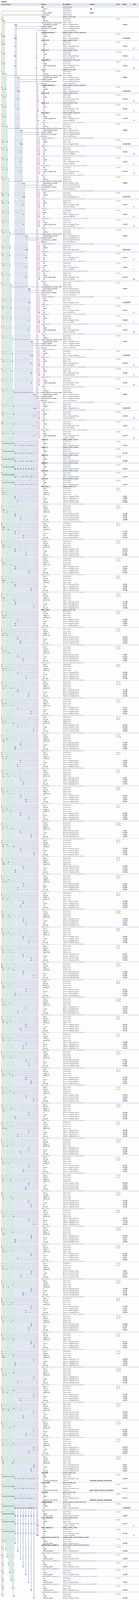
[diagram p0: system contents, whole]
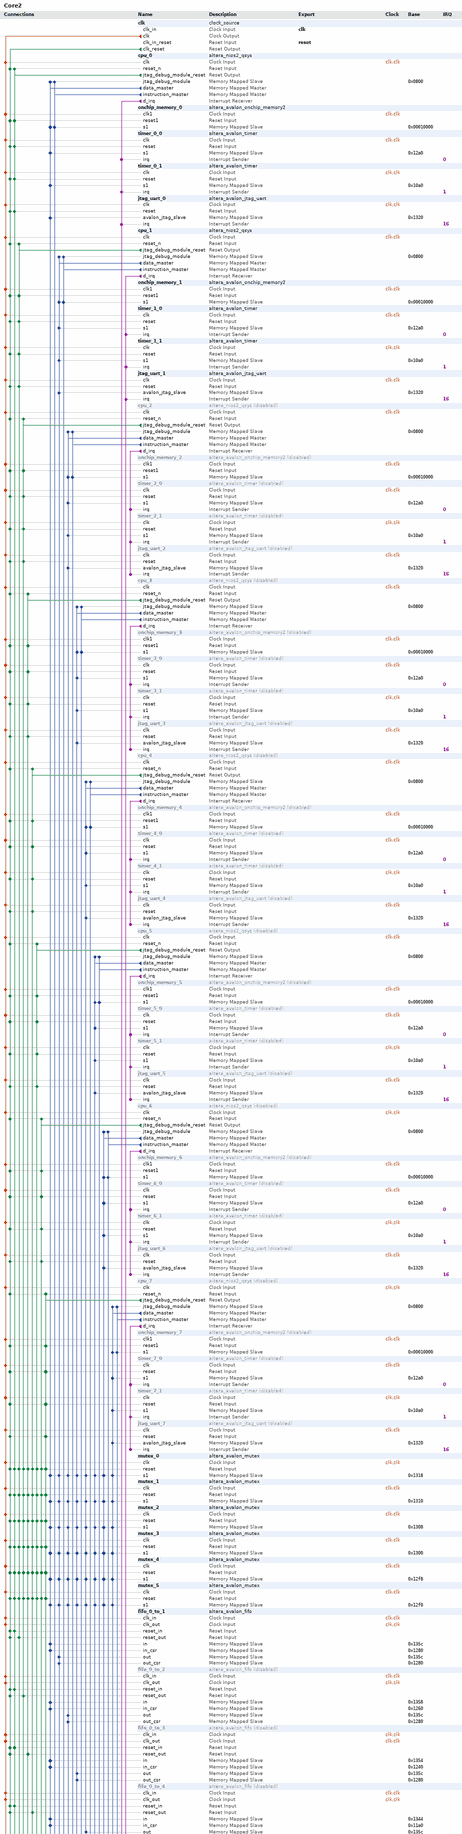
[diagram p1: system contents, upper part]
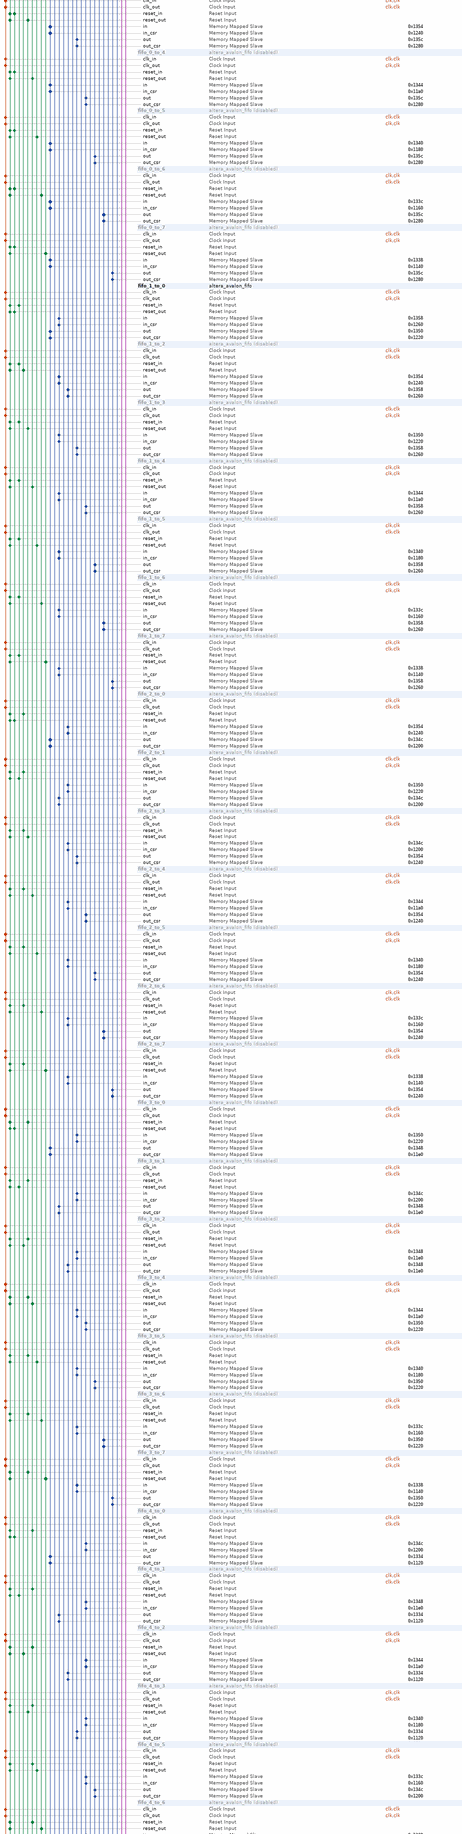
[diagram p2: system contents, middle part]
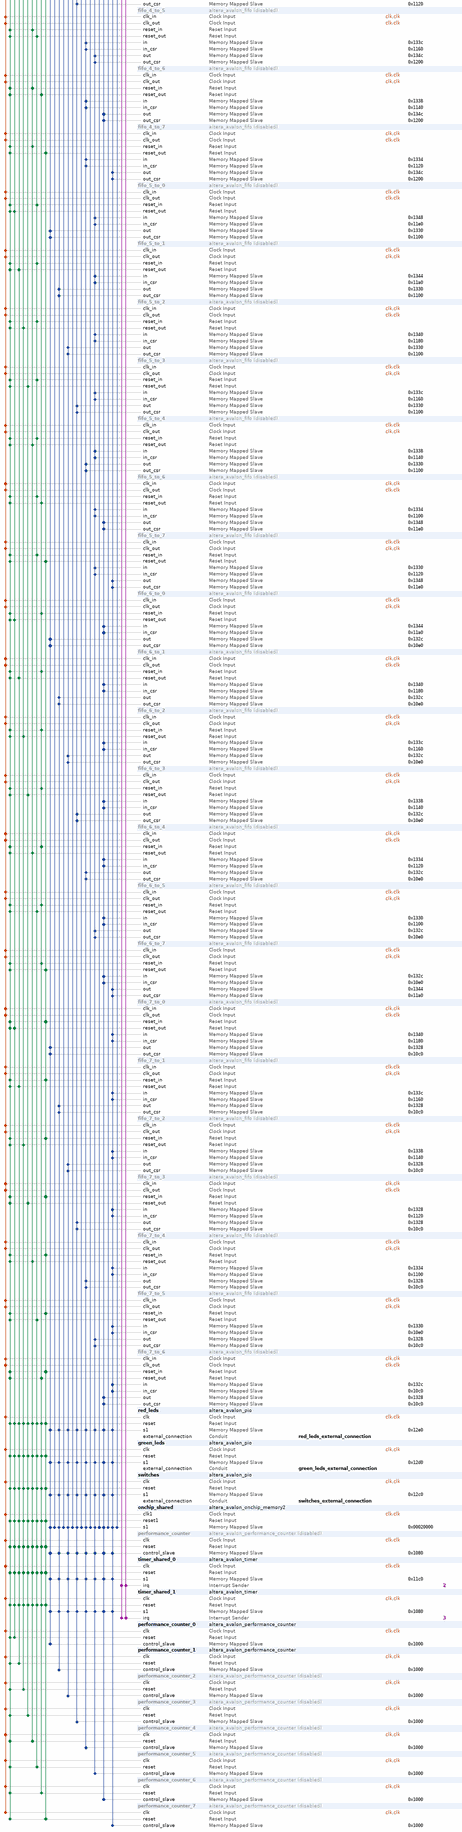
[diagram p3: system contents, lower part]
# Platform Designer (Qsys) system Core2, Cyclone IV E EP4CE115F29C7
# Parameters at their usual value, and those the tool derives, are not listed.
package require -exact qsys 13.0.1.99.2
create_system Core2
set_project_property DEVICE_FAMILY {Cyclone IV E}
set_project_property DEVICE EP4CE115F29C7

add_instance clk clock_source 13.0
set_instance_parameter_value clk clockFrequency 50000000

add_instance cpu_0 altera_nios2_qsys 13.0
set_instance_parameter_value cpu_0 cpuID 1
set_instance_parameter_value cpu_0 resetSlave onchip_memory_0.s1
set_instance_parameter_value cpu_0 mmu_TLBMissExcSlave None
set_instance_parameter_value cpu_0 exceptionSlave onchip_memory_0.s1
set_instance_parameter_value cpu_0 breakSlave cpu_0.jtag_debug_module
set_instance_parameter_value cpu_0 impl Tiny
set_instance_parameter_value cpu_0 icache_size 4096

add_instance onchip_memory_0 altera_avalon_onchip_memory2 13.0.1.99.2
set_instance_parameter_value onchip_memory_0 dataWidth 32
set_instance_parameter_value onchip_memory_0 dualPort false
set_instance_parameter_value onchip_memory_0 initMemContent true
set_instance_parameter_value onchip_memory_0 initializationFileName onchip_mem.hex
set_instance_parameter_value onchip_memory_0 memorySize 32768

add_instance timer_0_0 altera_avalon_timer 13.0.1.99.2
set_instance_parameter_value timer_0_0 period 1
set_instance_parameter_value timer_0_0 periodUnits MSEC

add_instance timer_0_1 altera_avalon_timer 13.0.1.99.2
set_instance_parameter_value timer_0_1 period 1
set_instance_parameter_value timer_0_1 periodUnits MSEC

add_instance jtag_uart_0 altera_avalon_jtag_uart 13.0.1.99.2
set_instance_parameter_value jtag_uart_0 simInteractiveOptions NO_INTERACTIVE_WINDOWS

add_instance cpu_1 altera_nios2_qsys 13.0
set_instance_parameter_value cpu_1 cpuID 2
set_instance_parameter_value cpu_1 resetSlave onchip_memory_1.s1
set_instance_parameter_value cpu_1 mmu_TLBMissExcSlave None
set_instance_parameter_value cpu_1 exceptionSlave onchip_memory_1.s1
set_instance_parameter_value cpu_1 breakSlave cpu_1.jtag_debug_module
set_instance_parameter_value cpu_1 impl Tiny
set_instance_parameter_value cpu_1 icache_size 4096

add_instance onchip_memory_1 altera_avalon_onchip_memory2 13.0.1.99.2
set_instance_parameter_value onchip_memory_1 dataWidth 32
set_instance_parameter_value onchip_memory_1 dualPort false
set_instance_parameter_value onchip_memory_1 initMemContent true
set_instance_parameter_value onchip_memory_1 initializationFileName onchip_mem.hex
set_instance_parameter_value onchip_memory_1 memorySize 32768

add_instance timer_1_0 altera_avalon_timer 13.0.1.99.2
set_instance_parameter_value timer_1_0 period 1
set_instance_parameter_value timer_1_0 periodUnits MSEC

add_instance timer_1_1 altera_avalon_timer 13.0.1.99.2
set_instance_parameter_value timer_1_1 period 1
set_instance_parameter_value timer_1_1 periodUnits MSEC

add_instance jtag_uart_1 altera_avalon_jtag_uart 13.0.1.99.2
set_instance_parameter_value jtag_uart_1 simInteractiveOptions NO_INTERACTIVE_WINDOWS

add_instance cpu_2 altera_nios2_qsys 13.0
set_instance_property cpu_2 ENABLED false
set_instance_parameter_value cpu_2 cpuID 3
set_instance_parameter_value cpu_2 resetSlave onchip_memory_2.s1
set_instance_parameter_value cpu_2 mmu_TLBMissExcSlave None
set_instance_parameter_value cpu_2 exceptionSlave onchip_memory_2.s1
set_instance_parameter_value cpu_2 breakSlave cpu_2.jtag_debug_module
set_instance_parameter_value cpu_2 impl Tiny
set_instance_parameter_value cpu_2 icache_size 4096

add_instance onchip_memory_2 altera_avalon_onchip_memory2 13.0.1.99.2
set_instance_property onchip_memory_2 ENABLED false
set_instance_parameter_value onchip_memory_2 dataWidth 32
set_instance_parameter_value onchip_memory_2 dualPort false
set_instance_parameter_value onchip_memory_2 initMemContent true
set_instance_parameter_value onchip_memory_2 initializationFileName onchip_mem.hex
set_instance_parameter_value onchip_memory_2 memorySize 32768

add_instance timer_2_0 altera_avalon_timer 13.0.1.99.2
set_instance_property timer_2_0 ENABLED false
set_instance_parameter_value timer_2_0 period 1
set_instance_parameter_value timer_2_0 periodUnits MSEC

add_instance timer_2_1 altera_avalon_timer 13.0.1.99.2
set_instance_property timer_2_1 ENABLED false
set_instance_parameter_value timer_2_1 period 1
set_instance_parameter_value timer_2_1 periodUnits MSEC

add_instance jtag_uart_2 altera_avalon_jtag_uart 13.0.1.99.2
set_instance_property jtag_uart_2 ENABLED false
set_instance_parameter_value jtag_uart_2 simInteractiveOptions NO_INTERACTIVE_WINDOWS

add_instance cpu_3 altera_nios2_qsys 13.0
set_instance_property cpu_3 ENABLED false
set_instance_parameter_value cpu_3 cpuID 4
set_instance_parameter_value cpu_3 resetSlave onchip_memory_3.s1
set_instance_parameter_value cpu_3 mmu_TLBMissExcSlave None
set_instance_parameter_value cpu_3 exceptionSlave onchip_memory_3.s1
set_instance_parameter_value cpu_3 breakSlave cpu_3.jtag_debug_module
set_instance_parameter_value cpu_3 impl Tiny
set_instance_parameter_value cpu_3 icache_size 4096

add_instance onchip_memory_3 altera_avalon_onchip_memory2 13.0.1.99.2
set_instance_property onchip_memory_3 ENABLED false
set_instance_parameter_value onchip_memory_3 dataWidth 32
set_instance_parameter_value onchip_memory_3 dualPort false
set_instance_parameter_value onchip_memory_3 initMemContent true
set_instance_parameter_value onchip_memory_3 initializationFileName onchip_mem.hex
set_instance_parameter_value onchip_memory_3 memorySize 32768

add_instance timer_3_0 altera_avalon_timer 13.0.1.99.2
set_instance_property timer_3_0 ENABLED false
set_instance_parameter_value timer_3_0 period 1
set_instance_parameter_value timer_3_0 periodUnits MSEC

add_instance timer_3_1 altera_avalon_timer 13.0.1.99.2
set_instance_property timer_3_1 ENABLED false
set_instance_parameter_value timer_3_1 period 1
set_instance_parameter_value timer_3_1 periodUnits MSEC

add_instance jtag_uart_3 altera_avalon_jtag_uart 13.0.1.99.2
set_instance_property jtag_uart_3 ENABLED false
set_instance_parameter_value jtag_uart_3 simInteractiveOptions NO_INTERACTIVE_WINDOWS

add_instance cpu_4 altera_nios2_qsys 13.0
set_instance_property cpu_4 ENABLED false
set_instance_parameter_value cpu_4 cpuID 5
set_instance_parameter_value cpu_4 resetSlave onchip_memory_4.s1
set_instance_parameter_value cpu_4 mmu_TLBMissExcSlave None
set_instance_parameter_value cpu_4 exceptionSlave onchip_memory_4.s1
set_instance_parameter_value cpu_4 breakSlave cpu_4.jtag_debug_module
set_instance_parameter_value cpu_4 impl Tiny
set_instance_parameter_value cpu_4 icache_size 4096

add_instance onchip_memory_4 altera_avalon_onchip_memory2 13.0.1.99.2
set_instance_property onchip_memory_4 ENABLED false
set_instance_parameter_value onchip_memory_4 dataWidth 32
set_instance_parameter_value onchip_memory_4 dualPort false
set_instance_parameter_value onchip_memory_4 initMemContent true
set_instance_parameter_value onchip_memory_4 initializationFileName onchip_mem.hex
set_instance_parameter_value onchip_memory_4 memorySize 32768

add_instance timer_4_0 altera_avalon_timer 13.0.1.99.2
set_instance_property timer_4_0 ENABLED false
set_instance_parameter_value timer_4_0 period 1
set_instance_parameter_value timer_4_0 periodUnits MSEC

add_instance timer_4_1 altera_avalon_timer 13.0.1.99.2
set_instance_property timer_4_1 ENABLED false
set_instance_parameter_value timer_4_1 period 1
set_instance_parameter_value timer_4_1 periodUnits MSEC

add_instance jtag_uart_4 altera_avalon_jtag_uart 13.0.1.99.2
set_instance_property jtag_uart_4 ENABLED false
set_instance_parameter_value jtag_uart_4 simInteractiveOptions NO_INTERACTIVE_WINDOWS

add_instance cpu_5 altera_nios2_qsys 13.0
set_instance_property cpu_5 ENABLED false
set_instance_parameter_value cpu_5 cpuID 6
set_instance_parameter_value cpu_5 resetSlave onchip_memory_5.s1
set_instance_parameter_value cpu_5 mmu_TLBMissExcSlave None
set_instance_parameter_value cpu_5 exceptionSlave onchip_memory_5.s1
set_instance_parameter_value cpu_5 breakSlave cpu_5.jtag_debug_module
set_instance_parameter_value cpu_5 impl Tiny
set_instance_parameter_value cpu_5 icache_size 4096

add_instance onchip_memory_5 altera_avalon_onchip_memory2 13.0.1.99.2
set_instance_property onchip_memory_5 ENABLED false
set_instance_parameter_value onchip_memory_5 dataWidth 32
set_instance_parameter_value onchip_memory_5 dualPort false
set_instance_parameter_value onchip_memory_5 initMemContent true
set_instance_parameter_value onchip_memory_5 initializationFileName onchip_mem.hex
set_instance_parameter_value onchip_memory_5 memorySize 32768

add_instance timer_5_0 altera_avalon_timer 13.0.1.99.2
set_instance_property timer_5_0 ENABLED false
set_instance_parameter_value timer_5_0 period 1
set_instance_parameter_value timer_5_0 periodUnits MSEC

add_instance timer_5_1 altera_avalon_timer 13.0.1.99.2
set_instance_property timer_5_1 ENABLED false
set_instance_parameter_value timer_5_1 period 1
set_instance_parameter_value timer_5_1 periodUnits MSEC

add_instance jtag_uart_5 altera_avalon_jtag_uart 13.0.1.99.2
set_instance_property jtag_uart_5 ENABLED false
set_instance_parameter_value jtag_uart_5 simInteractiveOptions NO_INTERACTIVE_WINDOWS

add_instance cpu_6 altera_nios2_qsys 13.0
set_instance_property cpu_6 ENABLED false
set_instance_parameter_value cpu_6 cpuID 7
set_instance_parameter_value cpu_6 resetSlave onchip_memory_6.s1
set_instance_parameter_value cpu_6 mmu_TLBMissExcSlave None
set_instance_parameter_value cpu_6 exceptionSlave onchip_memory_6.s1
set_instance_parameter_value cpu_6 breakSlave cpu_6.jtag_debug_module
set_instance_parameter_value cpu_6 impl Tiny
set_instance_parameter_value cpu_6 icache_size 4096

add_instance onchip_memory_6 altera_avalon_onchip_memory2 13.0.1.99.2
set_instance_property onchip_memory_6 ENABLED false
set_instance_parameter_value onchip_memory_6 dataWidth 32
set_instance_parameter_value onchip_memory_6 dualPort false
set_instance_parameter_value onchip_memory_6 initMemContent true
set_instance_parameter_value onchip_memory_6 initializationFileName onchip_mem.hex
set_instance_parameter_value onchip_memory_6 memorySize 32768

add_instance timer_6_0 altera_avalon_timer 13.0.1.99.2
set_instance_property timer_6_0 ENABLED false
set_instance_parameter_value timer_6_0 period 1
set_instance_parameter_value timer_6_0 periodUnits MSEC

add_instance timer_6_1 altera_avalon_timer 13.0.1.99.2
set_instance_property timer_6_1 ENABLED false
set_instance_parameter_value timer_6_1 period 1
set_instance_parameter_value timer_6_1 periodUnits MSEC

add_instance jtag_uart_6 altera_avalon_jtag_uart 13.0.1.99.2
set_instance_property jtag_uart_6 ENABLED false
set_instance_parameter_value jtag_uart_6 simInteractiveOptions NO_INTERACTIVE_WINDOWS

add_instance cpu_7 altera_nios2_qsys 13.0
set_instance_property cpu_7 ENABLED false
set_instance_parameter_value cpu_7 cpuID 8
set_instance_parameter_value cpu_7 resetSlave onchip_memory_7.s1
set_instance_parameter_value cpu_7 mmu_TLBMissExcSlave None
set_instance_parameter_value cpu_7 exceptionSlave onchip_memory_7.s1
set_instance_parameter_value cpu_7 breakSlave cpu_7.jtag_debug_module
set_instance_parameter_value cpu_7 impl Tiny
set_instance_parameter_value cpu_7 icache_size 4096

add_instance onchip_memory_7 altera_avalon_onchip_memory2 13.0.1.99.2
set_instance_property onchip_memory_7 ENABLED false
set_instance_parameter_value onchip_memory_7 dataWidth 32
set_instance_parameter_value onchip_memory_7 dualPort false
set_instance_parameter_value onchip_memory_7 initMemContent true
set_instance_parameter_value onchip_memory_7 initializationFileName onchip_mem.hex
set_instance_parameter_value onchip_memory_7 memorySize 32768

add_instance timer_7_0 altera_avalon_timer 13.0.1.99.2
set_instance_property timer_7_0 ENABLED false
set_instance_parameter_value timer_7_0 period 1
set_instance_parameter_value timer_7_0 periodUnits MSEC

add_instance timer_7_1 altera_avalon_timer 13.0.1.99.2
set_instance_property timer_7_1 ENABLED false
set_instance_parameter_value timer_7_1 period 1
set_instance_parameter_value timer_7_1 periodUnits MSEC

add_instance jtag_uart_7 altera_avalon_jtag_uart 13.0.1.99.2
set_instance_property jtag_uart_7 ENABLED false
set_instance_parameter_value jtag_uart_7 simInteractiveOptions NO_INTERACTIVE_WINDOWS

add_instance mutex_0 altera_avalon_mutex 13.0.1.99.2

add_instance mutex_1 altera_avalon_mutex 13.0.1.99.2

add_instance mutex_2 altera_avalon_mutex 13.0.1.99.2

add_instance mutex_3 altera_avalon_mutex 13.0.1.99.2

add_instance mutex_4 altera_avalon_mutex 13.0.1.99.2

add_instance mutex_5 altera_avalon_mutex 13.0.1.99.2

add_instance fifo_0_to_1 altera_avalon_fifo 13.0.1.99.2
set_instance_parameter_value fifo_0_to_1 bitsPerSymbol 16
set_instance_parameter_value fifo_0_to_1 channelWidth 8
set_instance_parameter_value fifo_0_to_1 errorWidth 8
set_instance_parameter_value fifo_0_to_1 fifoDepth 16
set_instance_parameter_value fifo_0_to_1 fifoInputInterfaceOptions AVALONMM_WRITE
set_instance_parameter_value fifo_0_to_1 fifoOutputInterfaceOptions AVALONMM_READ
set_instance_parameter_value fifo_0_to_1 singleClockMode false
set_instance_parameter_value fifo_0_to_1 symbolsPerBeat 2
set_instance_parameter_value fifo_0_to_1 useIRQ false
set_instance_parameter_value fifo_0_to_1 usePacket true
set_instance_parameter_value fifo_0_to_1 useReadControl true

add_instance fifo_0_to_2 altera_avalon_fifo 13.0.1.99.2
set_instance_property fifo_0_to_2 ENABLED false
set_instance_parameter_value fifo_0_to_2 bitsPerSymbol 16
set_instance_parameter_value fifo_0_to_2 channelWidth 8
set_instance_parameter_value fifo_0_to_2 errorWidth 8
set_instance_parameter_value fifo_0_to_2 fifoDepth 16
set_instance_parameter_value fifo_0_to_2 fifoInputInterfaceOptions AVALONMM_WRITE
set_instance_parameter_value fifo_0_to_2 fifoOutputInterfaceOptions AVALONMM_READ
set_instance_parameter_value fifo_0_to_2 singleClockMode false
set_instance_parameter_value fifo_0_to_2 symbolsPerBeat 2
set_instance_parameter_value fifo_0_to_2 useIRQ false
set_instance_parameter_value fifo_0_to_2 usePacket true
set_instance_parameter_value fifo_0_to_2 useReadControl true

add_instance fifo_0_to_3 altera_avalon_fifo 13.0.1.99.2
set_instance_property fifo_0_to_3 ENABLED false
set_instance_parameter_value fifo_0_to_3 bitsPerSymbol 16
set_instance_parameter_value fifo_0_to_3 channelWidth 8
set_instance_parameter_value fifo_0_to_3 errorWidth 8
set_instance_parameter_value fifo_0_to_3 fifoDepth 16
set_instance_parameter_value fifo_0_to_3 fifoInputInterfaceOptions AVALONMM_WRITE
set_instance_parameter_value fifo_0_to_3 fifoOutputInterfaceOptions AVALONMM_READ
set_instance_parameter_value fifo_0_to_3 singleClockMode false
set_instance_parameter_value fifo_0_to_3 symbolsPerBeat 2
set_instance_parameter_value fifo_0_to_3 useIRQ false
set_instance_parameter_value fifo_0_to_3 usePacket true
set_instance_parameter_value fifo_0_to_3 useReadControl true

add_instance fifo_0_to_4 altera_avalon_fifo 13.0.1.99.2
set_instance_property fifo_0_to_4 ENABLED false
set_instance_parameter_value fifo_0_to_4 bitsPerSymbol 16
set_instance_parameter_value fifo_0_to_4 channelWidth 8
set_instance_parameter_value fifo_0_to_4 errorWidth 8
set_instance_parameter_value fifo_0_to_4 fifoDepth 16
set_instance_parameter_value fifo_0_to_4 fifoInputInterfaceOptions AVALONMM_WRITE
set_instance_parameter_value fifo_0_to_4 fifoOutputInterfaceOptions AVALONMM_READ
set_instance_parameter_value fifo_0_to_4 singleClockMode false
set_instance_parameter_value fifo_0_to_4 symbolsPerBeat 2
set_instance_parameter_value fifo_0_to_4 useIRQ false
set_instance_parameter_value fifo_0_to_4 usePacket true
set_instance_parameter_value fifo_0_to_4 useReadControl true

add_instance fifo_0_to_5 altera_avalon_fifo 13.0.1.99.2
set_instance_property fifo_0_to_5 ENABLED false
set_instance_parameter_value fifo_0_to_5 bitsPerSymbol 16
set_instance_parameter_value fifo_0_to_5 channelWidth 8
set_instance_parameter_value fifo_0_to_5 errorWidth 8
set_instance_parameter_value fifo_0_to_5 fifoDepth 16
set_instance_parameter_value fifo_0_to_5 fifoInputInterfaceOptions AVALONMM_WRITE
set_instance_parameter_value fifo_0_to_5 fifoOutputInterfaceOptions AVALONMM_READ
set_instance_parameter_value fifo_0_to_5 singleClockMode false
set_instance_parameter_value fifo_0_to_5 symbolsPerBeat 2
set_instance_parameter_value fifo_0_to_5 useIRQ false
set_instance_parameter_value fifo_0_to_5 usePacket true
set_instance_parameter_value fifo_0_to_5 useReadControl true

add_instance fifo_0_to_6 altera_avalon_fifo 13.0.1.99.2
set_instance_property fifo_0_to_6 ENABLED false
set_instance_parameter_value fifo_0_to_6 bitsPerSymbol 16
set_instance_parameter_value fifo_0_to_6 channelWidth 8
set_instance_parameter_value fifo_0_to_6 errorWidth 8
set_instance_parameter_value fifo_0_to_6 fifoDepth 16
set_instance_parameter_value fifo_0_to_6 fifoInputInterfaceOptions AVALONMM_WRITE
set_instance_parameter_value fifo_0_to_6 fifoOutputInterfaceOptions AVALONMM_READ
set_instance_parameter_value fifo_0_to_6 singleClockMode false
set_instance_parameter_value fifo_0_to_6 symbolsPerBeat 2
set_instance_parameter_value fifo_0_to_6 useIRQ false
set_instance_parameter_value fifo_0_to_6 usePacket true
set_instance_parameter_value fifo_0_to_6 useReadControl true

add_instance fifo_0_to_7 altera_avalon_fifo 13.0.1.99.2
set_instance_property fifo_0_to_7 ENABLED false
set_instance_parameter_value fifo_0_to_7 bitsPerSymbol 16
set_instance_parameter_value fifo_0_to_7 channelWidth 8
set_instance_parameter_value fifo_0_to_7 errorWidth 8
set_instance_parameter_value fifo_0_to_7 fifoDepth 16
set_instance_parameter_value fifo_0_to_7 fifoInputInterfaceOptions AVALONMM_WRITE
set_instance_parameter_value fifo_0_to_7 fifoOutputInterfaceOptions AVALONMM_READ
set_instance_parameter_value fifo_0_to_7 singleClockMode false
set_instance_parameter_value fifo_0_to_7 symbolsPerBeat 2
set_instance_parameter_value fifo_0_to_7 useIRQ false
set_instance_parameter_value fifo_0_to_7 usePacket true
set_instance_parameter_value fifo_0_to_7 useReadControl true

add_instance fifo_1_to_0 altera_avalon_fifo 13.0.1.99.2
set_instance_parameter_value fifo_1_to_0 bitsPerSymbol 16
set_instance_parameter_value fifo_1_to_0 channelWidth 8
set_instance_parameter_value fifo_1_to_0 errorWidth 8
set_instance_parameter_value fifo_1_to_0 fifoDepth 16
set_instance_parameter_value fifo_1_to_0 fifoInputInterfaceOptions AVALONMM_WRITE
set_instance_parameter_value fifo_1_to_0 fifoOutputInterfaceOptions AVALONMM_READ
set_instance_parameter_value fifo_1_to_0 singleClockMode false
set_instance_parameter_value fifo_1_to_0 symbolsPerBeat 2
set_instance_parameter_value fifo_1_to_0 useIRQ false
set_instance_parameter_value fifo_1_to_0 usePacket true
set_instance_parameter_value fifo_1_to_0 useReadControl true

add_instance fifo_1_to_2 altera_avalon_fifo 13.0.1.99.2
set_instance_property fifo_1_to_2 ENABLED false
set_instance_parameter_value fifo_1_to_2 bitsPerSymbol 16
set_instance_parameter_value fifo_1_to_2 channelWidth 8
set_instance_parameter_value fifo_1_to_2 errorWidth 8
set_instance_parameter_value fifo_1_to_2 fifoDepth 16
set_instance_parameter_value fifo_1_to_2 fifoInputInterfaceOptions AVALONMM_WRITE
set_instance_parameter_value fifo_1_to_2 fifoOutputInterfaceOptions AVALONMM_READ
set_instance_parameter_value fifo_1_to_2 singleClockMode false
set_instance_parameter_value fifo_1_to_2 symbolsPerBeat 2
set_instance_parameter_value fifo_1_to_2 useIRQ false
set_instance_parameter_value fifo_1_to_2 usePacket true
set_instance_parameter_value fifo_1_to_2 useReadControl true

add_instance fifo_1_to_3 altera_avalon_fifo 13.0.1.99.2
set_instance_property fifo_1_to_3 ENABLED false
set_instance_parameter_value fifo_1_to_3 bitsPerSymbol 16
set_instance_parameter_value fifo_1_to_3 channelWidth 8
set_instance_parameter_value fifo_1_to_3 errorWidth 8
set_instance_parameter_value fifo_1_to_3 fifoDepth 16
set_instance_parameter_value fifo_1_to_3 fifoInputInterfaceOptions AVALONMM_WRITE
set_instance_parameter_value fifo_1_to_3 fifoOutputInterfaceOptions AVALONMM_READ
set_instance_parameter_value fifo_1_to_3 singleClockMode false
set_instance_parameter_value fifo_1_to_3 symbolsPerBeat 2
set_instance_parameter_value fifo_1_to_3 useIRQ false
set_instance_parameter_value fifo_1_to_3 usePacket true
set_instance_parameter_value fifo_1_to_3 useReadControl true

add_instance fifo_1_to_4 altera_avalon_fifo 13.0.1.99.2
set_instance_property fifo_1_to_4 ENABLED false
set_instance_parameter_value fifo_1_to_4 bitsPerSymbol 16
set_instance_parameter_value fifo_1_to_4 channelWidth 8
set_instance_parameter_value fifo_1_to_4 errorWidth 8
set_instance_parameter_value fifo_1_to_4 fifoDepth 16
set_instance_parameter_value fifo_1_to_4 fifoInputInterfaceOptions AVALONMM_WRITE
set_instance_parameter_value fifo_1_to_4 fifoOutputInterfaceOptions AVALONMM_READ
set_instance_parameter_value fifo_1_to_4 singleClockMode false
set_instance_parameter_value fifo_1_to_4 symbolsPerBeat 2
set_instance_parameter_value fifo_1_to_4 useIRQ false
set_instance_parameter_value fifo_1_to_4 usePacket true
set_instance_parameter_value fifo_1_to_4 useReadControl true

add_instance fifo_1_to_5 altera_avalon_fifo 13.0.1.99.2
set_instance_property fifo_1_to_5 ENABLED false
set_instance_parameter_value fifo_1_to_5 bitsPerSymbol 16
set_instance_parameter_value fifo_1_to_5 channelWidth 8
set_instance_parameter_value fifo_1_to_5 errorWidth 8
set_instance_parameter_value fifo_1_to_5 fifoDepth 16
set_instance_parameter_value fifo_1_to_5 fifoInputInterfaceOptions AVALONMM_WRITE
set_instance_parameter_value fifo_1_to_5 fifoOutputInterfaceOptions AVALONMM_READ
set_instance_parameter_value fifo_1_to_5 singleClockMode false
set_instance_parameter_value fifo_1_to_5 symbolsPerBeat 2
set_instance_parameter_value fifo_1_to_5 useIRQ false
set_instance_parameter_value fifo_1_to_5 usePacket true
set_instance_parameter_value fifo_1_to_5 useReadControl true

add_instance fifo_1_to_6 altera_avalon_fifo 13.0.1.99.2
set_instance_property fifo_1_to_6 ENABLED false
set_instance_parameter_value fifo_1_to_6 bitsPerSymbol 16
set_instance_parameter_value fifo_1_to_6 channelWidth 8
set_instance_parameter_value fifo_1_to_6 errorWidth 8
set_instance_parameter_value fifo_1_to_6 fifoDepth 16
set_instance_parameter_value fifo_1_to_6 fifoInputInterfaceOptions AVALONMM_WRITE
set_instance_parameter_value fifo_1_to_6 fifoOutputInterfaceOptions AVALONMM_READ
set_instance_parameter_value fifo_1_to_6 singleClockMode false
set_instance_parameter_value fifo_1_to_6 symbolsPerBeat 2
set_instance_parameter_value fifo_1_to_6 useIRQ false
set_instance_parameter_value fifo_1_to_6 usePacket true
set_instance_parameter_value fifo_1_to_6 useReadControl true

add_instance fifo_1_to_7 altera_avalon_fifo 13.0.1.99.2
set_instance_property fifo_1_to_7 ENABLED false
set_instance_parameter_value fifo_1_to_7 bitsPerSymbol 16
set_instance_parameter_value fifo_1_to_7 channelWidth 8
set_instance_parameter_value fifo_1_to_7 errorWidth 8
set_instance_parameter_value fifo_1_to_7 fifoDepth 16
set_instance_parameter_value fifo_1_to_7 fifoInputInterfaceOptions AVALONMM_WRITE
set_instance_parameter_value fifo_1_to_7 fifoOutputInterfaceOptions AVALONMM_READ
set_instance_parameter_value fifo_1_to_7 singleClockMode false
set_instance_parameter_value fifo_1_to_7 symbolsPerBeat 2
set_instance_parameter_value fifo_1_to_7 useIRQ false
set_instance_parameter_value fifo_1_to_7 usePacket true
set_instance_parameter_value fifo_1_to_7 useReadControl true

add_instance fifo_2_to_0 altera_avalon_fifo 13.0.1.99.2
set_instance_property fifo_2_to_0 ENABLED false
set_instance_parameter_value fifo_2_to_0 bitsPerSymbol 16
set_instance_parameter_value fifo_2_to_0 channelWidth 8
set_instance_parameter_value fifo_2_to_0 errorWidth 8
set_instance_parameter_value fifo_2_to_0 fifoDepth 16
set_instance_parameter_value fifo_2_to_0 fifoInputInterfaceOptions AVALONMM_WRITE
set_instance_parameter_value fifo_2_to_0 fifoOutputInterfaceOptions AVALONMM_READ
set_instance_parameter_value fifo_2_to_0 singleClockMode false
set_instance_parameter_value fifo_2_to_0 symbolsPerBeat 2
set_instance_parameter_value fifo_2_to_0 useIRQ false
set_instance_parameter_value fifo_2_to_0 usePacket true
set_instance_parameter_value fifo_2_to_0 useReadControl true

add_instance fifo_2_to_1 altera_avalon_fifo 13.0.1.99.2
set_instance_property fifo_2_to_1 ENABLED false
set_instance_parameter_value fifo_2_to_1 bitsPerSymbol 16
set_instance_parameter_value fifo_2_to_1 channelWidth 8
set_instance_parameter_value fifo_2_to_1 errorWidth 8
set_instance_parameter_value fifo_2_to_1 fifoDepth 16
set_instance_parameter_value fifo_2_to_1 fifoInputInterfaceOptions AVALONMM_WRITE
set_instance_parameter_value fifo_2_to_1 fifoOutputInterfaceOptions AVALONMM_READ
set_instance_parameter_value fifo_2_to_1 singleClockMode false
set_instance_parameter_value fifo_2_to_1 symbolsPerBeat 2
set_instance_parameter_value fifo_2_to_1 useIRQ false
set_instance_parameter_value fifo_2_to_1 usePacket true
set_instance_parameter_value fifo_2_to_1 useReadControl true

add_instance fifo_2_to_3 altera_avalon_fifo 13.0.1.99.2
set_instance_property fifo_2_to_3 ENABLED false
set_instance_parameter_value fifo_2_to_3 bitsPerSymbol 16
set_instance_parameter_value fifo_2_to_3 channelWidth 8
set_instance_parameter_value fifo_2_to_3 errorWidth 8
set_instance_parameter_value fifo_2_to_3 fifoDepth 16
set_instance_parameter_value fifo_2_to_3 fifoInputInterfaceOptions AVALONMM_WRITE
set_instance_parameter_value fifo_2_to_3 fifoOutputInterfaceOptions AVALONMM_READ
set_instance_parameter_value fifo_2_to_3 singleClockMode false
set_instance_parameter_value fifo_2_to_3 symbolsPerBeat 2
set_instance_parameter_value fifo_2_to_3 useIRQ false
set_instance_parameter_value fifo_2_to_3 usePacket true
set_instance_parameter_value fifo_2_to_3 useReadControl true

add_instance fifo_2_to_4 altera_avalon_fifo 13.0.1.99.2
set_instance_property fifo_2_to_4 ENABLED false
set_instance_parameter_value fifo_2_to_4 bitsPerSymbol 16
set_instance_parameter_value fifo_2_to_4 channelWidth 8
set_instance_parameter_value fifo_2_to_4 errorWidth 8
set_instance_parameter_value fifo_2_to_4 fifoDepth 16
set_instance_parameter_value fifo_2_to_4 fifoInputInterfaceOptions AVALONMM_WRITE
set_instance_parameter_value fifo_2_to_4 fifoOutputInterfaceOptions AVALONMM_READ
set_instance_parameter_value fifo_2_to_4 singleClockMode false
set_instance_parameter_value fifo_2_to_4 symbolsPerBeat 2
set_instance_parameter_value fifo_2_to_4 useIRQ false
set_instance_parameter_value fifo_2_to_4 usePacket true
set_instance_parameter_value fifo_2_to_4 useReadControl true

add_instance fifo_2_to_5 altera_avalon_fifo 13.0.1.99.2
set_instance_property fifo_2_to_5 ENABLED false
set_instance_parameter_value fifo_2_to_5 bitsPerSymbol 16
set_instance_parameter_value fifo_2_to_5 channelWidth 8
set_instance_parameter_value fifo_2_to_5 errorWidth 8
set_instance_parameter_value fifo_2_to_5 fifoDepth 16
set_instance_parameter_value fifo_2_to_5 fifoInputInterfaceOptions AVALONMM_WRITE
set_instance_parameter_value fifo_2_to_5 fifoOutputInterfaceOptions AVALONMM_READ
set_instance_parameter_value fifo_2_to_5 singleClockMode false
set_instance_parameter_value fifo_2_to_5 symbolsPerBeat 2
set_instance_parameter_value fifo_2_to_5 useIRQ false
set_instance_parameter_value fifo_2_to_5 usePacket true
set_instance_parameter_value fifo_2_to_5 useReadControl true

add_instance fifo_2_to_6 altera_avalon_fifo 13.0.1.99.2
set_instance_property fifo_2_to_6 ENABLED false
set_instance_parameter_value fifo_2_to_6 bitsPerSymbol 16
set_instance_parameter_value fifo_2_to_6 channelWidth 8
set_instance_parameter_value fifo_2_to_6 errorWidth 8
set_instance_parameter_value fifo_2_to_6 fifoDepth 16
set_instance_parameter_value fifo_2_to_6 fifoInputInterfaceOptions AVALONMM_WRITE
set_instance_parameter_value fifo_2_to_6 fifoOutputInterfaceOptions AVALONMM_READ
set_instance_parameter_value fifo_2_to_6 singleClockMode false
set_instance_parameter_value fifo_2_to_6 symbolsPerBeat 2
set_instance_parameter_value fifo_2_to_6 useIRQ false
set_instance_parameter_value fifo_2_to_6 usePacket true
set_instance_parameter_value fifo_2_to_6 useReadControl true

add_instance fifo_2_to_7 altera_avalon_fifo 13.0.1.99.2
set_instance_property fifo_2_to_7 ENABLED false
set_instance_parameter_value fifo_2_to_7 bitsPerSymbol 16
set_instance_parameter_value fifo_2_to_7 channelWidth 8
set_instance_parameter_value fifo_2_to_7 errorWidth 8
set_instance_parameter_value fifo_2_to_7 fifoDepth 16
set_instance_parameter_value fifo_2_to_7 fifoInputInterfaceOptions AVALONMM_WRITE
set_instance_parameter_value fifo_2_to_7 fifoOutputInterfaceOptions AVALONMM_READ
set_instance_parameter_value fifo_2_to_7 singleClockMode false
set_instance_parameter_value fifo_2_to_7 symbolsPerBeat 2
set_instance_parameter_value fifo_2_to_7 useIRQ false
set_instance_parameter_value fifo_2_to_7 usePacket true
set_instance_parameter_value fifo_2_to_7 useReadControl true

add_instance fifo_3_to_0 altera_avalon_fifo 13.0.1.99.2
set_instance_property fifo_3_to_0 ENABLED false
set_instance_parameter_value fifo_3_to_0 bitsPerSymbol 16
set_instance_parameter_value fifo_3_to_0 channelWidth 8
set_instance_parameter_value fifo_3_to_0 errorWidth 8
set_instance_parameter_value fifo_3_to_0 fifoDepth 16
set_instance_parameter_value fifo_3_to_0 fifoInputInterfaceOptions AVALONMM_WRITE
set_instance_parameter_value fifo_3_to_0 fifoOutputInterfaceOptions AVALONMM_READ
set_instance_parameter_value fifo_3_to_0 singleClockMode false
set_instance_parameter_value fifo_3_to_0 symbolsPerBeat 2
set_instance_parameter_value fifo_3_to_0 useIRQ false
set_instance_parameter_value fifo_3_to_0 usePacket true
set_instance_parameter_value fifo_3_to_0 useReadControl true

add_instance fifo_3_to_1 altera_avalon_fifo 13.0.1.99.2
set_instance_property fifo_3_to_1 ENABLED false
set_instance_parameter_value fifo_3_to_1 bitsPerSymbol 16
set_instance_parameter_value fifo_3_to_1 channelWidth 8
set_instance_parameter_value fifo_3_to_1 errorWidth 8
set_instance_parameter_value fifo_3_to_1 fifoDepth 16
set_instance_parameter_value fifo_3_to_1 fifoInputInterfaceOptions AVALONMM_WRITE
set_instance_parameter_value fifo_3_to_1 fifoOutputInterfaceOptions AVALONMM_READ
set_instance_parameter_value fifo_3_to_1 singleClockMode false
set_instance_parameter_value fifo_3_to_1 symbolsPerBeat 2
set_instance_parameter_value fifo_3_to_1 useIRQ false
set_instance_parameter_value fifo_3_to_1 usePacket true
set_instance_parameter_value fifo_3_to_1 useReadControl true

add_instance fifo_3_to_2 altera_avalon_fifo 13.0.1.99.2
set_instance_property fifo_3_to_2 ENABLED false
set_instance_parameter_value fifo_3_to_2 bitsPerSymbol 16
set_instance_parameter_value fifo_3_to_2 channelWidth 8
set_instance_parameter_value fifo_3_to_2 errorWidth 8
set_instance_parameter_value fifo_3_to_2 fifoDepth 16
set_instance_parameter_value fifo_3_to_2 fifoInputInterfaceOptions AVALONMM_WRITE
set_instance_parameter_value fifo_3_to_2 fifoOutputInterfaceOptions AVALONMM_READ
set_instance_parameter_value fifo_3_to_2 singleClockMode false
set_instance_parameter_value fifo_3_to_2 symbolsPerBeat 2
set_instance_parameter_value fifo_3_to_2 useIRQ false
set_instance_parameter_value fifo_3_to_2 usePacket true
set_instance_parameter_value fifo_3_to_2 useReadControl true

add_instance fifo_3_to_4 altera_avalon_fifo 13.0.1.99.2
set_instance_property fifo_3_to_4 ENABLED false
set_instance_parameter_value fifo_3_to_4 bitsPerSymbol 16
set_instance_parameter_value fifo_3_to_4 channelWidth 8
set_instance_parameter_value fifo_3_to_4 errorWidth 8
set_instance_parameter_value fifo_3_to_4 fifoDepth 16
set_instance_parameter_value fifo_3_to_4 fifoInputInterfaceOptions AVALONMM_WRITE
set_instance_parameter_value fifo_3_to_4 fifoOutputInterfaceOptions AVALONMM_READ
set_instance_parameter_value fifo_3_to_4 singleClockMode false
set_instance_parameter_value fifo_3_to_4 symbolsPerBeat 2
set_instance_parameter_value fifo_3_to_4 useIRQ false
set_instance_parameter_value fifo_3_to_4 usePacket true
set_instance_parameter_value fifo_3_to_4 useReadControl true

add_instance fifo_3_to_5 altera_avalon_fifo 13.0.1.99.2
set_instance_property fifo_3_to_5 ENABLED false
set_instance_parameter_value fifo_3_to_5 bitsPerSymbol 16
set_instance_parameter_value fifo_3_to_5 channelWidth 8
set_instance_parameter_value fifo_3_to_5 errorWidth 8
set_instance_parameter_value fifo_3_to_5 fifoDepth 16
set_instance_parameter_value fifo_3_to_5 fifoInputInterfaceOptions AVALONMM_WRITE
set_instance_parameter_value fifo_3_to_5 fifoOutputInterfaceOptions AVALONMM_READ
set_instance_parameter_value fifo_3_to_5 singleClockMode false
set_instance_parameter_value fifo_3_to_5 symbolsPerBeat 2
set_instance_parameter_value fifo_3_to_5 useIRQ false
set_instance_parameter_value fifo_3_to_5 usePacket true
set_instance_parameter_value fifo_3_to_5 useReadControl true

add_instance fifo_3_to_6 altera_avalon_fifo 13.0.1.99.2
set_instance_property fifo_3_to_6 ENABLED false
set_instance_parameter_value fifo_3_to_6 bitsPerSymbol 16
set_instance_parameter_value fifo_3_to_6 channelWidth 8
set_instance_parameter_value fifo_3_to_6 errorWidth 8
set_instance_parameter_value fifo_3_to_6 fifoDepth 16
set_instance_parameter_value fifo_3_to_6 fifoInputInterfaceOptions AVALONMM_WRITE
set_instance_parameter_value fifo_3_to_6 fifoOutputInterfaceOptions AVALONMM_READ
set_instance_parameter_value fifo_3_to_6 singleClockMode false
set_instance_parameter_value fifo_3_to_6 symbolsPerBeat 2
set_instance_parameter_value fifo_3_to_6 useIRQ false
set_instance_parameter_value fifo_3_to_6 usePacket true
set_instance_parameter_value fifo_3_to_6 useReadControl true

add_instance fifo_3_to_7 altera_avalon_fifo 13.0.1.99.2
set_instance_property fifo_3_to_7 ENABLED false
set_instance_parameter_value fifo_3_to_7 bitsPerSymbol 16
set_instance_parameter_value fifo_3_to_7 channelWidth 8
set_instance_parameter_value fifo_3_to_7 errorWidth 8
set_instance_parameter_value fifo_3_to_7 fifoDepth 16
set_instance_parameter_value fifo_3_to_7 fifoInputInterfaceOptions AVALONMM_WRITE
set_instance_parameter_value fifo_3_to_7 fifoOutputInterfaceOptions AVALONMM_READ
set_instance_parameter_value fifo_3_to_7 singleClockMode false
set_instance_parameter_value fifo_3_to_7 symbolsPerBeat 2
set_instance_parameter_value fifo_3_to_7 useIRQ false
set_instance_parameter_value fifo_3_to_7 usePacket true
set_instance_parameter_value fifo_3_to_7 useReadControl true

add_instance fifo_4_to_0 altera_avalon_fifo 13.0.1.99.2
set_instance_property fifo_4_to_0 ENABLED false
set_instance_parameter_value fifo_4_to_0 bitsPerSymbol 16
set_instance_parameter_value fifo_4_to_0 channelWidth 8
set_instance_parameter_value fifo_4_to_0 errorWidth 8
set_instance_parameter_value fifo_4_to_0 fifoDepth 16
set_instance_parameter_value fifo_4_to_0 fifoInputInterfaceOptions AVALONMM_WRITE
set_instance_parameter_value fifo_4_to_0 fifoOutputInterfaceOptions AVALONMM_READ
set_instance_parameter_value fifo_4_to_0 singleClockMode false
set_instance_parameter_value fifo_4_to_0 symbolsPerBeat 2
set_instance_parameter_value fifo_4_to_0 useIRQ false
set_instance_parameter_value fifo_4_to_0 usePacket true
set_instance_parameter_value fifo_4_to_0 useReadControl true

add_instance fifo_4_to_1 altera_avalon_fifo 13.0.1.99.2
set_instance_property fifo_4_to_1 ENABLED false
set_instance_parameter_value fifo_4_to_1 bitsPerSymbol 16
set_instance_parameter_value fifo_4_to_1 channelWidth 8
set_instance_parameter_value fifo_4_to_1 errorWidth 8
set_instance_parameter_value fifo_4_to_1 fifoDepth 16
set_instance_parameter_value fifo_4_to_1 fifoInputInterfaceOptions AVALONMM_WRITE
set_instance_parameter_value fifo_4_to_1 fifoOutputInterfaceOptions AVALONMM_READ
set_instance_parameter_value fifo_4_to_1 singleClockMode false
set_instance_parameter_value fifo_4_to_1 symbolsPerBeat 2
set_instance_parameter_value fifo_4_to_1 useIRQ false
set_instance_parameter_value fifo_4_to_1 usePacket true
set_instance_parameter_value fifo_4_to_1 useReadControl true

add_instance fifo_4_to_2 altera_avalon_fifo 13.0.1.99.2
set_instance_property fifo_4_to_2 ENABLED false
set_instance_parameter_value fifo_4_to_2 bitsPerSymbol 16
set_instance_parameter_value fifo_4_to_2 channelWidth 8
set_instance_parameter_value fifo_4_to_2 errorWidth 8
set_instance_parameter_value fifo_4_to_2 fifoDepth 16
set_instance_parameter_value fifo_4_to_2 fifoInputInterfaceOptions AVALONMM_WRITE
set_instance_parameter_value fifo_4_to_2 fifoOutputInterfaceOptions AVALONMM_READ
set_instance_parameter_value fifo_4_to_2 singleClockMode false
set_instance_parameter_value fifo_4_to_2 symbolsPerBeat 2
set_instance_parameter_value fifo_4_to_2 useIRQ false
set_instance_parameter_value fifo_4_to_2 usePacket true
set_instance_parameter_value fifo_4_to_2 useReadControl true

add_instance fifo_4_to_3 altera_avalon_fifo 13.0.1.99.2
set_instance_property fifo_4_to_3 ENABLED false
set_instance_parameter_value fifo_4_to_3 bitsPerSymbol 16
set_instance_parameter_value fifo_4_to_3 channelWidth 8
set_instance_parameter_value fifo_4_to_3 errorWidth 8
set_instance_parameter_value fifo_4_to_3 fifoDepth 16
set_instance_parameter_value fifo_4_to_3 fifoInputInterfaceOptions AVALONMM_WRITE
set_instance_parameter_value fifo_4_to_3 fifoOutputInterfaceOptions AVALONMM_READ
set_instance_parameter_value fifo_4_to_3 singleClockMode false
set_instance_parameter_value fifo_4_to_3 symbolsPerBeat 2
set_instance_parameter_value fifo_4_to_3 useIRQ false
set_instance_parameter_value fifo_4_to_3 usePacket true
set_instance_parameter_value fifo_4_to_3 useReadControl true

add_instance fifo_4_to_5 altera_avalon_fifo 13.0.1.99.2
set_instance_property fifo_4_to_5 ENABLED false
set_instance_parameter_value fifo_4_to_5 bitsPerSymbol 16
set_instance_parameter_value fifo_4_to_5 channelWidth 8
set_instance_parameter_value fifo_4_to_5 errorWidth 8
set_instance_parameter_value fifo_4_to_5 fifoDepth 16
set_instance_parameter_value fifo_4_to_5 fifoInputInterfaceOptions AVALONMM_WRITE
set_instance_parameter_value fifo_4_to_5 fifoOutputInterfaceOptions AVALONMM_READ
set_instance_parameter_value fifo_4_to_5 singleClockMode false
set_instance_parameter_value fifo_4_to_5 symbolsPerBeat 2
set_instance_parameter_value fifo_4_to_5 useIRQ false
set_instance_parameter_value fifo_4_to_5 usePacket true
set_instance_parameter_value fifo_4_to_5 useReadControl true

add_instance fifo_4_to_6 altera_avalon_fifo 13.0.1.99.2
set_instance_property fifo_4_to_6 ENABLED false
set_instance_parameter_value fifo_4_to_6 bitsPerSymbol 16
set_instance_parameter_value fifo_4_to_6 channelWidth 8
set_instance_parameter_value fifo_4_to_6 errorWidth 8
set_instance_parameter_value fifo_4_to_6 fifoDepth 16
set_instance_parameter_value fifo_4_to_6 fifoInputInterfaceOptions AVALONMM_WRITE
set_instance_parameter_value fifo_4_to_6 fifoOutputInterfaceOptions AVALONMM_READ
set_instance_parameter_value fifo_4_to_6 singleClockMode false
set_instance_parameter_value fifo_4_to_6 symbolsPerBeat 2
set_instance_parameter_value fifo_4_to_6 useIRQ false
set_instance_parameter_value fifo_4_to_6 usePacket true
set_instance_parameter_value fifo_4_to_6 useReadControl true

add_instance fifo_4_to_7 altera_avalon_fifo 13.0.1.99.2
set_instance_property fifo_4_to_7 ENABLED false
set_instance_parameter_value fifo_4_to_7 bitsPerSymbol 16
set_instance_parameter_value fifo_4_to_7 channelWidth 8
set_instance_parameter_value fifo_4_to_7 errorWidth 8
set_instance_parameter_value fifo_4_to_7 fifoDepth 16
set_instance_parameter_value fifo_4_to_7 fifoInputInterfaceOptions AVALONMM_WRITE
set_instance_parameter_value fifo_4_to_7 fifoOutputInterfaceOptions AVALONMM_READ
set_instance_parameter_value fifo_4_to_7 singleClockMode false
set_instance_parameter_value fifo_4_to_7 symbolsPerBeat 2
set_instance_parameter_value fifo_4_to_7 useIRQ false
set_instance_parameter_value fifo_4_to_7 usePacket true
set_instance_parameter_value fifo_4_to_7 useReadControl true

add_instance fifo_5_to_0 altera_avalon_fifo 13.0.1.99.2
set_instance_property fifo_5_to_0 ENABLED false
set_instance_parameter_value fifo_5_to_0 bitsPerSymbol 16
set_instance_parameter_value fifo_5_to_0 channelWidth 8
set_instance_parameter_value fifo_5_to_0 errorWidth 8
set_instance_parameter_value fifo_5_to_0 fifoDepth 16
set_instance_parameter_value fifo_5_to_0 fifoInputInterfaceOptions AVALONMM_WRITE
set_instance_parameter_value fifo_5_to_0 fifoOutputInterfaceOptions AVALONMM_READ
set_instance_parameter_value fifo_5_to_0 singleClockMode false
set_instance_parameter_value fifo_5_to_0 symbolsPerBeat 2
set_instance_parameter_value fifo_5_to_0 useIRQ false
set_instance_parameter_value fifo_5_to_0 usePacket true
set_instance_parameter_value fifo_5_to_0 useReadControl true

add_instance fifo_5_to_1 altera_avalon_fifo 13.0.1.99.2
set_instance_property fifo_5_to_1 ENABLED false
set_instance_parameter_value fifo_5_to_1 bitsPerSymbol 16
set_instance_parameter_value fifo_5_to_1 channelWidth 8
set_instance_parameter_value fifo_5_to_1 errorWidth 8
set_instance_parameter_value fifo_5_to_1 fifoDepth 16
set_instance_parameter_value fifo_5_to_1 fifoInputInterfaceOptions AVALONMM_WRITE
set_instance_parameter_value fifo_5_to_1 fifoOutputInterfaceOptions AVALONMM_READ
set_instance_parameter_value fifo_5_to_1 singleClockMode false
set_instance_parameter_value fifo_5_to_1 symbolsPerBeat 2
set_instance_parameter_value fifo_5_to_1 useIRQ false
set_instance_parameter_value fifo_5_to_1 usePacket true
set_instance_parameter_value fifo_5_to_1 useReadControl true

add_instance fifo_5_to_2 altera_avalon_fifo 13.0.1.99.2
set_instance_property fifo_5_to_2 ENABLED false
set_instance_parameter_value fifo_5_to_2 bitsPerSymbol 16
set_instance_parameter_value fifo_5_to_2 channelWidth 8
set_instance_parameter_value fifo_5_to_2 errorWidth 8
set_instance_parameter_value fifo_5_to_2 fifoDepth 16
set_instance_parameter_value fifo_5_to_2 fifoInputInterfaceOptions AVALONMM_WRITE
set_instance_parameter_value fifo_5_to_2 fifoOutputInterfaceOptions AVALONMM_READ
set_instance_parameter_value fifo_5_to_2 singleClockMode false
set_instance_parameter_value fifo_5_to_2 symbolsPerBeat 2
set_instance_parameter_value fifo_5_to_2 useIRQ false
set_instance_parameter_value fifo_5_to_2 usePacket true
set_instance_parameter_value fifo_5_to_2 useReadControl true

add_instance fifo_5_to_3 altera_avalon_fifo 13.0.1.99.2
set_instance_property fifo_5_to_3 ENABLED false
set_instance_parameter_value fifo_5_to_3 bitsPerSymbol 16
set_instance_parameter_value fifo_5_to_3 channelWidth 8
set_instance_parameter_value fifo_5_to_3 errorWidth 8
set_instance_parameter_value fifo_5_to_3 fifoDepth 16
set_instance_parameter_value fifo_5_to_3 fifoInputInterfaceOptions AVALONMM_WRITE
set_instance_parameter_value fifo_5_to_3 fifoOutputInterfaceOptions AVALONMM_READ
set_instance_parameter_value fifo_5_to_3 singleClockMode false
set_instance_parameter_value fifo_5_to_3 symbolsPerBeat 2
set_instance_parameter_value fifo_5_to_3 useIRQ false
set_instance_parameter_value fifo_5_to_3 usePacket true
set_instance_parameter_value fifo_5_to_3 useReadControl true
